# Altium project Cubesat EPS.PrjPcb (part 3 of 4)

## Sheet 3V3_EPS.SchDoc
size 420 x 297 mm; SheetNumber: 4; SheetTotal: 21
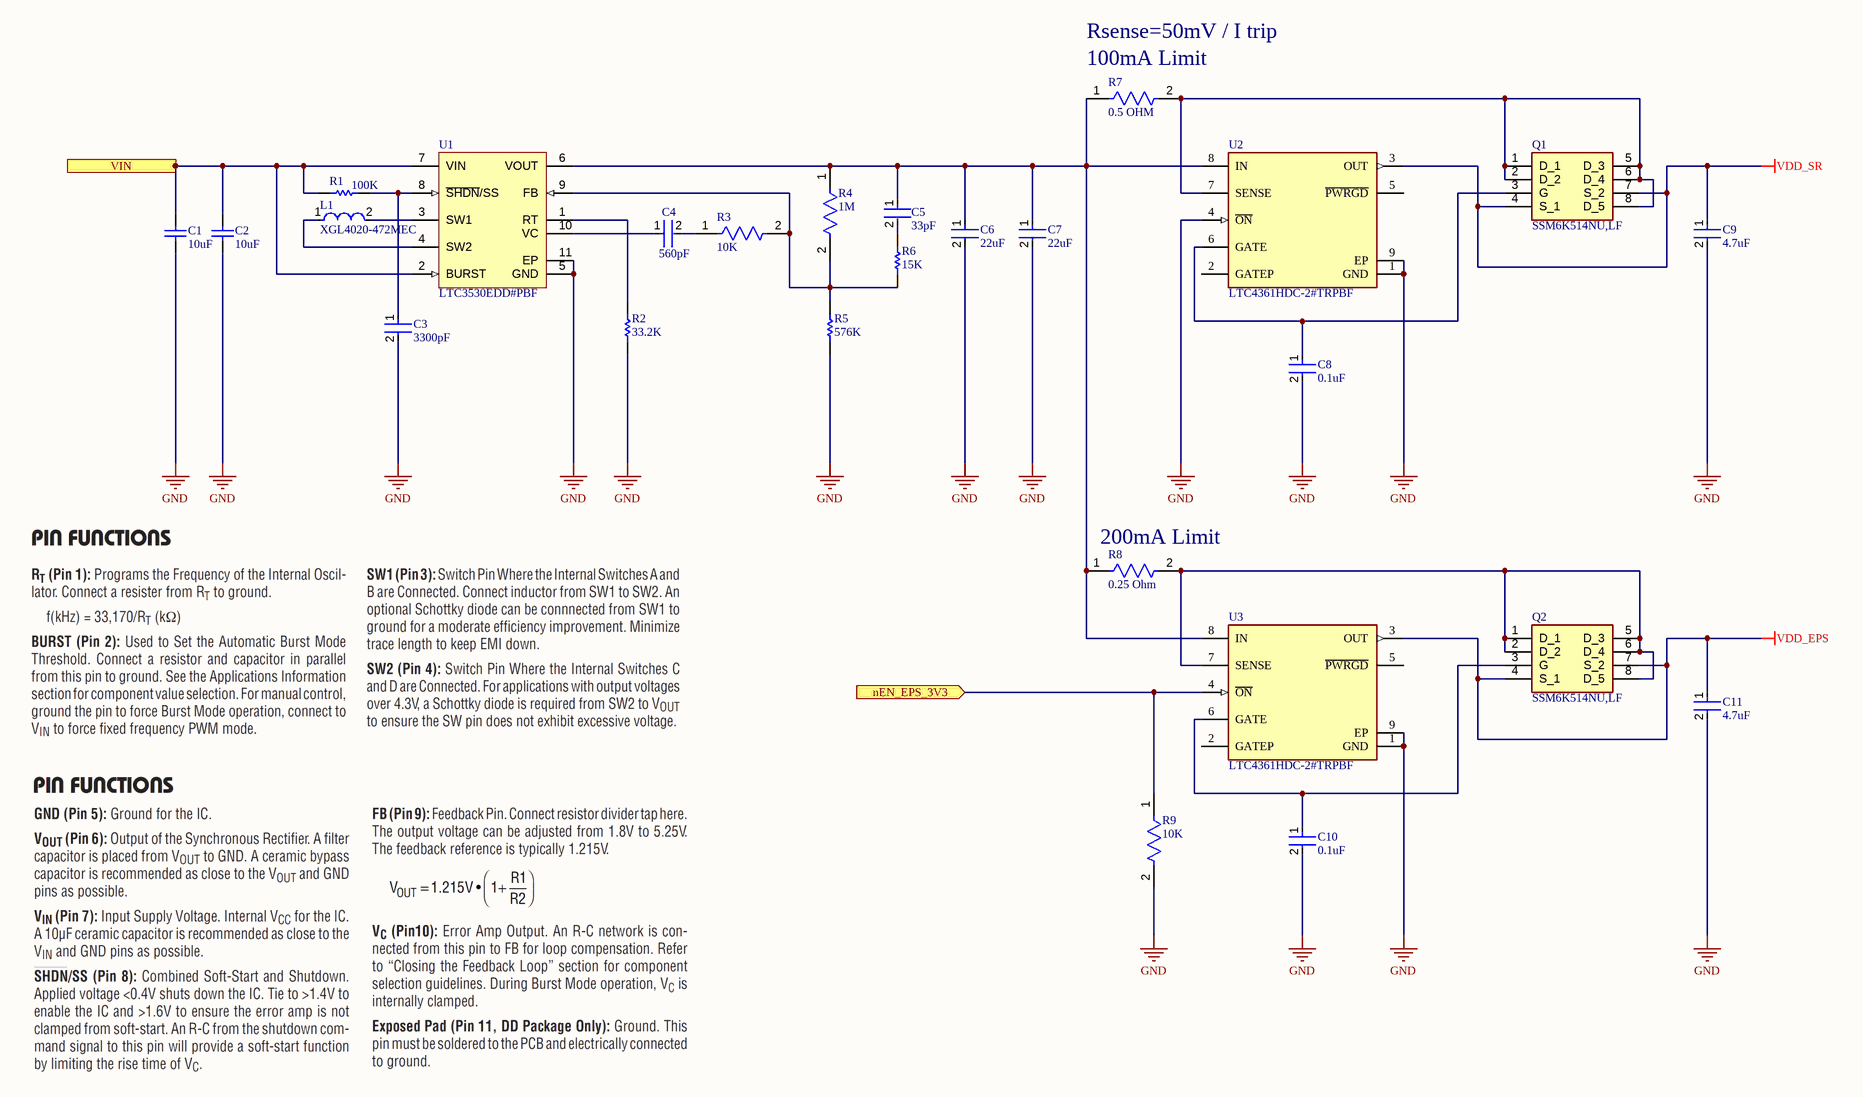
[diagram p13: 3V3_EPS.SchDoc]

### Parts
C1  10uF  [CAPC2013X140X45NL15T25]
C2  10uF  [CAPC2013X140X45NL15T25]
C3  3300pF  [FP-C0603C-CF-MFG]
C4  560pF  [FP-C0603C-CF-MFG]
C5  33pF  [FP-C0603C-CF-MFG]
C6  22uF  [FP-GRM21B-0_2-e0_2_0_7-IPC_C]
C7  22uF  [FP-GRM21B-0_2-e0_2_0_7-IPC_C]
C8  0.1uF  [FP-C0603C-CF-MFG]
C9  4.7uF  [FP-GRM188-0_15-IPC_A]
C10  0.1uF  [FP-C0603C-CF-MFG]
C11  4.7uF  [FP-GRM188-0_15-IPC_A]
L1  XGL4020-472MEC  [FP-XGL4020-MFG]
Q1  SSM6K514NU,LF  [UDFN6B]
Q2  SSM6K514NU,LF  [UDFN6B]
R1  100K  [RESC1608X55X30ML20T10]
R2  33.2K  [RESC1608X55X30NL15T15]
R3  10K  [FP-RK73B1J-MFG]
R4  1M  [FP-ERJ3EK-IPC_C]
R5  576K  [RESC1608X55X30LL15T15]
R6  15K  [RESC1608X55X30NL20T10]
R7  0.5 OHM  [FP-CSR0603-IPC_A]
R8  0.25 Ohm  [FP-CSR0603-IPC_A]
R9  10K  [FP-RK73B1J-MFG]
U1  LTC3530EDD#PBF  [LT-DD-10_V]
U2  LTC4361HDC-2#TRPBF  [FP-DC8-8-05-08-1719-IPC_C]
U3  LTC4361HDC-2#TRPBF  [FP-DC8-8-05-08-1719-IPC_C]

### Ports
nEN_EPS_3V3 (in), VIN

### Nets
GND: C1.1 C2.1 C3.2 C6.2 C7.2 C8.2 C9.2 C10.2 C11.2 R2.1 R5.1 R9.2 U1.5(GND) U1.11(EP) U2.1(GND) U2.4(~{ON}) U2.9(EP) U3.1(GND) U3.9(EP)
VDD_EPS: C11.1 Q2.4(S_1) Q2.7(S_2) U3.3(OUT)
VDD_SR: C9.1 Q1.4(S_1) Q1.7(S_2) U2.3(OUT)
nEN_EPS_3V3: R9.1 U3.4(~{ON}) ; port nEN_EPS_3V3
VBUS: C1.2 C2.2 R1.2 U1.2(BURST) U1.7(VIN) ; port VIN
NetC3_1: C3.1 R1.1 U1.8(~{SHDN}/SS)
NetC4_1: C4.1 U1.10(VC)
NetC4_2: C4.2 R3.1
NetC5_1: C5.1 C6.1 C7.1 R4.1 R7.1 R8.1 U1.6(VOUT) U2.8(IN) U3.8(IN)
NetC5_2: C5.2 R6.2
NetC8_1: C8.1 Q1.3(G) U2.6(GATE)
NetC10_1: C10.1 Q2.3(G) U3.6(GATE)
NetL1_1: L1.1 U1.4(SW2)
NetL1_2: L1.2 U1.3(SW1)
NetQ1_1: Q1.1(D_1) Q1.2(D_2) Q1.5(D_3) Q1.6(D_4) Q1.8(D_5) R7.2 U2.7(SENSE)
NetQ2_1: Q2.1(D_1) Q2.2(D_2) Q2.5(D_3) Q2.6(D_4) Q2.8(D_5) R8.2 U3.7(SENSE)
NetR2_2: R2.2 U1.1(RT)
NetR3_2: R3.2 R4.2 R5.2 R6.1 U1.9(FB)

Not connected (* = marked no-connect by the designer): U2 2(GATEP) 5(~{PWRGD}); U3 2(GATEP) 5(~{PWRGD})

### Notes on the sheet
- Rsense=50mV / I trip
- (near R7) 100mA Limit
- (near R8) 200mA Limit
- THIS DOCUMENT AND THE DATA DISCLOSED HEREIN OR
- HEREWITH IS THE PROPERTY OF ALTIUM LIMITED AND MAY
- DWG NO:
- REVISION
- REV:
- DESCRIPTION
- DATE
- APPROVED
- BE FREELY DISTRIBUTED IN WHOLE. NO RIGHTS ARE
- RESERVED OR EXPRESS OR IMPLIED WARANTEE GIVEN.
- ENG:
- APPROVALS
- PROJECT
- DSN:
- CHK:
- REFERENCE DOCUMENTS
- PROJECT REVISION:
- TITLE
- DOCUMENT REVISION:
- DESIGN ITEM:
- BOM:
- FAB DWG:
- PCB DWG:
- ASSY DWG:
- SCALE:
- A3
- SIZE
- CAGE CODE
- FILE NAME
- DWG NO.
- SHEET
- OF
- REV

### Library data of the parts
C1 C2 = CMP-2007-03395-1: 10uF 0805; Part Number: GRM21BR71A106KE51L; Manufacturer: Murata
C3 = CMP-2006-03174-2: CAP CER 3300PF 50V 5% X7R 0603; Manufacturer Part Number: C0603C332J5RACTU; Manufacturer: KEMET; Automotive Grade: Grade 1; Material: Ceramic; Value: 3,300 pF; Temperature Coefficient: 30ppm/°C; Tolerance: 0.05; Temperature Range Low: -55°C; Device Class L3: Ceramic Capacitors; Temperature Characteristic: X7R; Temperature: -55°C to +125°C; Device Class L1: Passive Components; ComponentLink2URL: https://api.kemet.com/component-edge/download/datasheet/C0603C100J5GACAUTO.pdf; Automotive: Yes; Capacitance: 3,300 pF; RoHS: TRUE; Mouser Description: Multilayer Ceramic Capacitors MLCC - SMD/SMT 50volts 3300pF X7R 5%; Height: 0.87mm; Temperature Range High: +125°C; ComponentLink2Description: Datasheet; Voltage Rating: 50 V; Octopart: https://octopart.com/c0603c332j5ractu-kemet-9139905; Package: C0603C-CF; Lead Free: Yes; Device Class L2: Capacitors; Digikey Description: CAP CER 3300PF 50V 5% X7R 0603; Category: Cap
C4 = CMP-2006-03245-2: CAP CER 560PF 50V X7R 0603; Manufacturer Part Number: C0603C561K5RACTU; Manufacturer: KEMET; Tolerance: 0.1; Material: Ceramic; Automotive Grade: Grade 1; Temperature Coefficient: 30ppm/°C; Temperature Range High: +125°C; Category: Cap; Voltage Rating: 50 V; Lead Free: Yes; RoHS: TRUE; Octopart: https://octopart.com/c0603c561k5ractu-kemet-138569; Device Class L3: Ceramic Capacitors; Temperature: -55°C to +125°C; Automotive: Yes; Device Class L1: Passive Components; Mouser Description: C0603C 560pF Ceramic Multilayer Capacitor, 50 VDC, +125degC, X7R Dielec, +/-10%; Capacitance: 560 pF; Temperature Characteristic: X7R; ComponentLink2URL: https://api.kemet.com/component-edge/download/datasheet/C0603C100J5GACAUTO.pdf; Temperature Range Low: -55°C; Digikey Description: CAP CER 560PF 50V X7R 0603; Device Class L2: Capacitors; ComponentLink2Description: Datasheet; Package: C0603C-CF; Value: 560 pF; Height: 0.87mm
C5 = CMP-03020-019617-1: CAP CER 33PF 16V X7R 0603; Manufacturer Part Number: C0603C330K4RAC7867; Manufacturer: KEMET; Material: Ceramic; Temperature Coefficient: 30ppm/°C; Automotive Grade: Grade 1; Tolerance: 0.1; Capacitance: 33 pF; ComponentLink2Description: Datasheet; ComponentLink2URL: https://api.kemet.com/component-edge/download/datasheet/C0603C100J5GACAUTO.pdf; Height: 0.87mm; Octopart: https://octopart.com/c0603c330k4rac7867-kemet-83501964; Temperature Characteristic: X7R; Temperature: -55°C to +125°C; RoHS: TRUE; Device Class L3: Ceramic Capacitors; Device Class L1: Passive Components; Digikey Description: CAP CER 33PF 16V X7R 0603; Lead Free: Yes; Temperature Range High: +125°C; Voltage Rating: 16 V; Package: C0603C-CF; Category: Cap; Automotive: Yes; Temperature Range Low: -55°C; Device Class L2: Capacitors; Value: 33 pF
C6 C7 = CMP-06035-025845-1: Chip Multilayer Ceramic Capacitors for General Purpose, 0805, 22uF, X7T, +22%/-33%, 20%, 10V; Dissipation Factor: 0.035%; Height: 1.25mm; Min Operating Temperature: -55°C; Case/Package: 0805; Packaging: Tape and Reel; Voltage: 10V; Depth: 1.25mm; Width: 1.25mm; Voltage Rating: 10V; Dielectric: X7T; Weight: 0.000335oz; Capacitance: 22uF; Mount: Surface Mount; Package Quantity: 3000; Lead Free: Lead Free; Tolerance: 20%; Thickness: 0.057inch; Max Operating Temperature: 125°C; Length: 2mm; Material: Ceramic; Case Code (Metric): 2012; Termination: SMD/SMT; Voltage Rating (DC): 10V; Dielectric Material: Ceramic; Case Code (Imperial): 0805
C8 C10 = CMP-2006-03054-2: CAP CER 0.1UF 16V X7R 0603; Manufacturer: KEMET; Manufacturer Part Number: C0603C104J4RACTU; Material: Ceramic; Capacitance: 0.10 μF; Tolerance: 0.05; Automotive Grade: Grade 1; Value: 0.10 μF; Temperature Coefficient: 30ppm/°C; Digikey Description: CAP CER 0.1UF 16V X7R 0603; Automotive: Yes; Octopart: https://octopart.com/c0603c104j4ractu-kemet-102515; Device Class L2: Capacitors; Temperature Characteristic: X7R; Category: Cap; Mouser Description: Cap Ceramic 0.1uF 16V X7R 5% SMD 0603 125°C Paper T/R; Voltage Rating: 16 V; Temperature Range Low: -55°C; Device Class L1: Passive Components; ComponentLink2URL: https://api.kemet.com/component-edge/download/datasheet/C0603C100J5GACAUTO.pdf; Lead Free: Yes; Temperature Range High: +125°C; Height: 0.87mm; Device Class L3: Ceramic Capacitors; ComponentLink2Description: Datasheet; Package: C0603C-CF; RoHS: TRUE; Temperature: -55°C to +125°C
C9 C11 = CMP-06035-000034-2: as C62 on sheet PMIC_Power; Height: 0.8mm; Termination: SMD/SMT; Case Code (Metric): 1608; Voltage Rating: 10V; Width: 0.8mm; Resistor Type: Ceramic; Length: 1.6mm; Voltage Rating (DC): 10V; Weight: 0.000222oz; Dielectric: X7S; Package Quantity: 4000; Mount: Surface Mount; Case Code (Imperial): 0603; Case/Package: 0603; Packaging: Tape and Reel; Thickness: 0.037inch; Min Operating Temperature: -55°C; Capacitance: 4.7uF; Max Operating Temperature: 125°C
L1 = CMP-11268-000013-1: Inductor, power, 4.7uH, SMT; Manufacturer: Coilcraft; Self Resonant Frequency: 23MHz; Saturation Current: 1.9A; Shielding: true; Test Frequency: 1MHz; Tolerance: 20%; Rms Current: 5.6A; Core Material: Composite; Series Resistance: 47.3mΩ; Automotive Grade: Grade 1; Standoff Height: 0.06mm; Inductance: 4.7uH; ComponentLink2Description: Datasheet; Value: 4.7uH; Automotive: Yes; RoHS: TRUE; Device Class L1: Passive Components; Category: Ind; Manufacturer Part Number: XGL4020-472MEC; ComponentLink2URL: https://www.coilcraft.com/pdfs/xgl4020.pdf; Ambient Temperature Range Low: -40°C; Height: 2.1mm; Octopart: https://octopart.com/xgl4020-472mec-coilcraft-99681031; Device Class L2: Inductors; Ambient Temperature Range High: +125°C; Package: XGL4020; Lead Free: Yes; Composition: Wirewound; Device Class L3: Fixed Inductors
Q1 Q2 = SSM6K514NU,LF: MOSFET (N-Channel); Manufacturer_Name: Toshiba; Datasheet Link: http://toshiba.semicon-storage.com/info/docget.jsp?did=29875&prodName=SSM6N7002CFU; Manufacturer_Part_Number: SSM6K514NU,LF; Mouser Part Number: 757-SSM6K514NULF; Mouser Price/Stock: https://www.mouser.co.uk/ProductDetail/Toshiba/SSM6K514NULF?qs=yfGysFjEcj13lHFOvblArQ%3D%3D; Arrow Part Number: SSM6K514NU,LF; Arrow Price/Stock: https://www.arrow.com/en/products/ssm6k514nulf/toshiba?region=nac
R1 = CMP-2000-01852-1: Part Number: RK73B1JTTD104J; Manufacturer: KOA Speer
R2 = CMP-2000-00441-1: Part Number: ERJ-3EKF3322V; Manufacturer: Panasonic
R3 R9 = CMP-2000-01851-2: as R67 on sheet PMIC_Watchdog; Length: 1.6mm; Lead Free: Lead Free; Resistance Tolerance: 5%; Case Code (Metric): 1608; Width: 0.8mm; Height: 0.45mm; Max Operating Temperature: 155°C; RoHS Compliant: Yes; Resistor Type: Thick Film; Min Operating Temperature: -55°C; Case Code (Imperial): 0603; Technology: THICK FILM; Package Quantity: 5000; Tolerance: 5%; Case/Package: 0603; Voltage Rating (DC): 50V; Depth: 0.8mm; Packaging: Tape and Reel; Number of Pins: 2; Construction: Rectangular; Series: RK73B; Military Standard: Not; Termination: SMD/SMT
R4 = CMP-1012-00849-3: RES SMD 1M OHM 1% 1/10W 0603; Resistance: 1MR; Voltage Rating: 75V; Temperature Coefficient: 100ppm/°C; Power Rating: 100mW; REACH SVHC: No SVHC; Radiation Hardening: No; Features: Automotive AEC-Q200; Case Code (Metric): 1608; Resistance Tolerance: 1%; Case/Package: 0603; Termination: SMD/SMT; Max Operating Temperature: 155°C; Tolerance: 1%; Size Code: 0603; Case Code (Imperial): 0603; Min Operating Temperature: -55°C; Number of Pins: 2; Mount: Surface Mount; Package Quantity: 1; Military Standard: Not; Voltage Rating (DC): 75V; Depth: 0.8mm; Packaging: Tape and Reel; Width: 0.8mm; Number of Terminations: 2; Length: 1.6mm; Height: 0.022inch; RoHS Compliant: Yes; Resistor Type: Thick Film; Contact Plating: Tin; Lead Free: Lead Free; Series: ERJ; Construction: Rectangular; Max Power Dissipation: 100mW
R5 = CMP-2000-00577-1: 576K Ohm 0603; Part Number: ERJ-3EKF5763V; Manufacturer: Panasonic
R6 = CMP-2000-01876-1: 15K Ohm 0603; Part Number: RK73B1JTTD153J; Manufacturer: KOA Speer
R7 = CMP-26527-000571-1: General Purpose Thick Film Chip Resistor, 0603, 0.5Ω, 1%, 300ppm/°C, 0.125W; Resistance: 500mR; Max Power Dissipation: 125mW; Resistor Type: Thick Film; Series: CSR; Case/Package: 0603; Mount: Surface Mount; Tolerance: 1%; Max Operating Temperature: 155°C; Width: 0.031inch; Length: 0.063inch; Min Operating Temperature: -55°C; Contact Plating: Tin; Size Code: 0603; Lead Free: Lead Free; Height: 0.022inch; Case Code (Imperial): 0603; Packaging: Tape and Reel; Power Rating: 125mW; RoHS Compliant: Yes; Case Code (Metric): 1608; Temperature Coefficient: 300ppm/°C; Number of Terminations: 2
R8 = CMP-26527-001850-1: General Purpose Thick Film Chip Resistor, 0603, 0.25Ω, 1%, 300ppm/°C, 0.125W; Max Power Dissipation: 125mW; Resistance: 250mR; Length: 0.063inch; Case Code (Metric): 1608; Temperature Coefficient: 300ppm/°C; Mount: Surface Mount; RoHS Compliant: Yes; Height: 0.022inch; Case/Package: 0603; Series: CSR; Max Operating Temperature: 155°C; Case Code (Imperial): 0603; Min Operating Temperature: -55°C; Lead Free: Lead Free; Resistor Type: Thick Film; Tolerance: 1%; Width: 0.031inch; Packaging: Tape and Reel; Number of Terminations: 2; Contact Plating: Tin
U1 = CMP-0492-00076-1: Wide Input Voltage Synchronous Buck-Boost DC/DC Converter, 10-pin SON (DD-10), -40 to 85 degC, Pb-Free; Manufacturer: Linear Technology; Frequency Adjust Range: 300kHz - 2MHz; Number of Outputs: 1; ComponentLink1URL: http://www.linear.com/; RoHS: TRUE; ComponentLink2URL: http://cds.linear.com/docs/en/datasheet/3530fb.pdf; ComponentLink3URL: http://cds.linear.com/docs/en/packaging/DFN_10_05-08-1699.pdf; PackageDescription: 10-Pin Plastic DFN, Body 3 x 3 mm, Pitch 0.5 mm; PackageReference: DD-10; ComponentLink1Description: Manufacturer URL; PackageVersion: Rev. C, 06/2010; Mounting Technology: Surface Mount; ComponentLink3Description: Package Specification; ComponentLink2Description: Datasheet; PartNumber: LTC3530EDD#PBF; DatasheetVersion: Rev. B; Code_JEDEC: MO-229
U2 U3 = CMP-0474-00015-2: IC OVP/OCP PROTECTION CTLR 8DFN; Number of Circuits: 1; RoHS Compliant: Yes; Packaging: Tape and Reel; Case/Package: DFN; Number of Pins: 8; Package Quantity: 2500

## Sheet UnRegPower.SchDoc
size 420 x 297 mm; SheetNumber: 8; SheetTotal: 21
Used 2 times, as channels M, N. Parts and nets are listed once, with the designators drawn on the sheet.
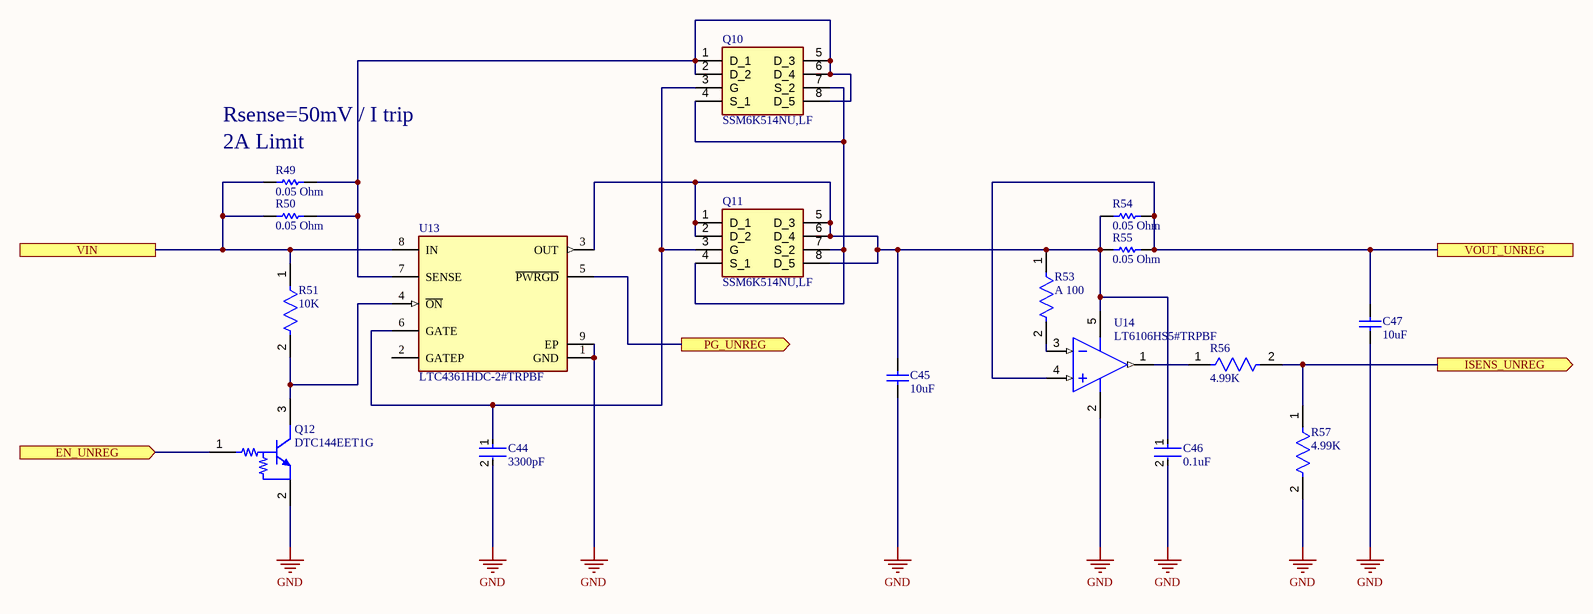
[diagram p14: UnRegPower.SchDoc]

### Parts
C44  3300pF  [FP-C0603C-CF-MFG]
C45  10uF  [CAPC2013X140X45NL15T25]
C46  0.1uF  [FP-C0603C-CF-MFG]
C47  10uF  [CAPC2013X140X45NL15T25]
Q10  SSM6K514NU,LF  [UDFN6B]
Q11  SSM6K514NU,LF  [UDFN6B]
Q12  DTC144EET1G  [ONSC-SC-75-3-463-01_V]
R49  0.05 Ohm  [RESC1608X55X30NL15T15]
R50  0.05 Ohm  [RESC1608X55X30NL15T15]
R51  10K  [FP-RK73B1J-MFG]
R53  A 100  [FP-ERA3A-IPC_B]
R54  0.05 Ohm  [RESC1608X55X30NL15T15]
R55  0.05 Ohm  [RESC1608X55X30NL15T15]
R56  4.99K  [FP-ERA3A-IPC_C]
R57  4.99K  [FP-ERA3A-IPC_C]
U13  LTC4361HDC-2#TRPBF  [FP-DC8-8-05-08-1719-IPC_C]
U14  LT6106HS5#TRPBF  [LT-S5-5-TSOT-23_M]

### Ports
EN_UNREG (in), ISENS_UNREG (out), PG_UNREG (out), VIN, VOUT_UNREG

### Nets
GND: C44.2 C45.1 C46.2 C47.1 Q12.2(E) R57.2 U13.1(GND) U13.9(EP) U14.2(V-)
EN_UNREG: Q12.1(B) ; port EN_UNREG
ISENS_UNREG: R56.2 R57.1 ; port ISENS_UNREG
PG_UNREG: U13.5(~{PWRGD}) ; port PG_UNREG
VIN: R49.1 R50.1 R51.1 U13.8(IN) ; port VIN
VOUT_UNREG: C47.2 R54.2 R55.2 U14.4(+IN) ; port VOUT_UNREG
NetC44_1: C44.1 Q10.3(G) Q11.3(G) U13.6(GATE)
NetC45_2: C45.2 C46.1 Q11.1(D_1) Q11.2(D_2) Q11.5(D_3) Q11.6(D_4) Q11.8(D_5) R53.1 R54.1 R55.1 U13.3(OUT) U14.5(V+)
NetQ10_1: Q10.1(D_1) Q10.2(D_2) Q10.5(D_3) Q10.6(D_4) Q10.8(D_5) R49.2 R50.2 U13.7(SENSE)
NetQ10_4: Q10.4(S_1) Q10.7(S_2) Q11.4(S_1) Q11.7(S_2)
NetQ12_3: Q12.3(C) R51.2 U13.4(~{ON})
NetR53_2: R53.2 U14.3(-IN)
NetR56_1: R56.1 U14.1(OUT)

Not connected (* = marked no-connect by the designer): U13 2(GATEP)

### Channels
M: designators end in _M; ports EN_UNREG=EN_UNREG1 ISENS_UNREG=ADC3_IN2 PG_UNREG=PG_UNREG1 VIN=VBUS VOUT_UNREG=UNREG_1
N: designators end in _N; ports EN_UNREG=EN_UNREG2 ISENS_UNREG=ADC3_IN1 PG_UNREG=PG_UNREG2 VIN=VBUS VOUT_UNREG=UNREG_2

### Notes on the sheet
- Rsense=50mV / I trip
- (near R49) 2A Limit
- THIS DOCUMENT AND THE DATA DISCLOSED HEREIN OR
- HEREWITH IS THE PROPERTY OF ALTIUM LIMITED AND MAY
- DWG NO:
- REVISION
- REV:
- DESCRIPTION
- DATE
- APPROVED
- BE FREELY DISTRIBUTED IN WHOLE. NO RIGHTS ARE
- RESERVED OR EXPRESS OR IMPLIED WARANTEE GIVEN.
- ENG:
- APPROVALS
- PROJECT
- DSN:
- CHK:
- REFERENCE DOCUMENTS
- PROJECT REVISION:
- TITLE
- DOCUMENT REVISION:
- DESIGN ITEM:
- BOM:
- FAB DWG:
- PCB DWG:
- ASSY DWG:
- SCALE:
- A3
- SIZE
- CAGE CODE
- FILE NAME
- DWG NO.
- SHEET
- OF
- REV

### Library data of the parts
C44 = CMP-2006-03174-2: as C3 on sheet 3V3_EPS; Temperature Range Low: -55°C; Device Class L3: Ceramic Capacitors; Temperature Characteristic: X7R; Temperature: -55°C to +125°C; Device Class L1: Passive Components; ComponentLink2URL: https://api.kemet.com/component-edge/download/datasheet/C0603C100J5GACAUTO.pdf; Automotive: Yes; Capacitance: 3,300 pF; RoHS: TRUE; Mouser Description: Multilayer Ceramic Capacitors MLCC - SMD/SMT 50volts 3300pF X7R 5%; Height: 0.87mm; Temperature Range High: +125°C; ComponentLink2Description: Datasheet; Voltage Rating: 50 V; Octopart: https://octopart.com/c0603c332j5ractu-kemet-9139905; Package: C0603C-CF; Lead Free: Yes; Device Class L2: Capacitors; Digikey Description: CAP CER 3300PF 50V 5% X7R 0603; Category: Cap
C45 C47 = CMP-2007-03395-1: Part Number: GRM21BR71A106KE51L; Manufacturer: Murata
C46 = CMP-2006-03061-2: as C67 on sheet PMIC_Watchdog; Temperature: -55°C to +125°C; RoHS: TRUE; Temperature Range High: +125°C; Lead Free: Yes; Octopart: https://octopart.com/c0603c104k5ractu-kemet-139244; Digikey Description: CAP CER 0.1UF 50V X7R 0603; Category: Cap; Package: C0603C-CF; ComponentLink2Description: Datasheet; Temperature Range Low: -55°C; Device Class L1: Passive Components; Voltage Rating: 50 V; Automotive: Yes; Device Class L3: Ceramic Capacitors; ComponentLink2URL: https://api.kemet.com/component-edge/download/datasheet/C0603C100J5GACAUTO.pdf; Capacitance: 0.10 μF; Device Class L2: Capacitors; Temperature Characteristic: X7R; Height: 0.87mm
Q10 Q11 = SSM6K514NU,LF: as Q1 on sheet 3V3_EPS; Datasheet Link: http://toshiba.semicon-storage.com/info/docget.jsp?did=29875&prodName=SSM6N7002CFU; Manufacturer_Part_Number: SSM6K514NU,LF; Mouser Part Number: 757-SSM6K514NULF; Mouser Price/Stock: https://www.mouser.co.uk/ProductDetail/Toshiba/SSM6K514NULF?qs=yfGysFjEcj13lHFOvblArQ%3D%3D; Arrow Part Number: SSM6K514NU,LF; Arrow Price/Stock: https://www.arrow.com/en/products/ssm6k514nulf/toshiba?region=nac
Q12 = CMP-0630-00198-1: Digital Transistor (BRT), R1=47 kOhm, R2=47 kOhm, NPN Transistor, 3-Pin SC-75, Pb-Free, Tape and Reel; Manufacturer: On Semiconductor; hFE Min: 80; R1/R2 Typ: 1; IC Continuous (A): 0.1; V(BR)CEO Min (V): 50; Mounting Technology: Surface Mount; PartNumber: DTC144EET1G; Polarity: NPN; PackageReference: SC-75-3-463-01; ComponentLink2URL: http://www.onsemi.cn/pub_link/Collateral/DTC144E-D.PDF; PackageVersion: Rev. F, 07/2005; ComponentLink3Description: Package Specification; ComponentLink1Description: Manufacturer URL; ComponentLink1URL: http://www.onsemi.com/; DatasheetVersion: Rev. 2; Packing: Tape and Reel; PackageDescription: 3-Pin Small Outline Transistor, Body 1.6 x 0.8 mm, Pitch 0.5 mm; ComponentLink2Description: Datasheet; RoHS: TRUE; ComponentLink3URL: http://www.onsemi.com/pub_link/Collateral/463-01.PDF
R49 R50 R54 R55 = CMP-2000-00867-1: Manufacturer: Panasonic; Part Number: ERJ-L03KF50MV
R51 = CMP-2000-01851-2: as R67 on sheet PMIC_Watchdog; Length: 1.6mm; Lead Free: Lead Free; Resistance Tolerance: 5%; Case Code (Metric): 1608; Width: 0.8mm; Height: 0.45mm; Max Operating Temperature: 155°C; RoHS Compliant: Yes; Resistor Type: Thick Film; Min Operating Temperature: -55°C; Case Code (Imperial): 0603; Technology: THICK FILM; Package Quantity: 5000; Tolerance: 5%; Case/Package: 0603; Voltage Rating (DC): 50V; Depth: 0.8mm; Packaging: Tape and Reel; Number of Pins: 2; Construction: Rectangular; Series: RK73B; Military Standard: Not; Termination: SMD/SMT
R53 = CMP-2000-00870-2: RES SMD 100 OHM 0.1% 1/10W 0603; Voltage Rating: 75V; Power Rating: 100mW; Resistance: 100R; Temperature Coefficient: 25ppm/°C; Number of Terminations: 2; Case/Package: 0603; Termination: SMD/SMT; Number of Pins: 2; Size Code: 0603; Length: 1.6mm; Min Operating Temperature: -55°C; Resistor Type: Thin Film; Depth: 0.8mm; Military Standard: Not; Packaging: Tape and Reel; RoHS Compliant: Yes; Construction: Rectangular; Resistance Tolerance: 0.1%; Contact Plating: Tin; Width: 0.8mm; Mount: Surface Mount; Case Code (Metric): 1608; Max Operating Temperature: 155°C; Height: 0.45mm; Case Code (Imperial): 0603; Series: ERA-3A; Package Quantity: 5000; REACH SVHC: No SVHC; Tolerance: 0.1%; Max Power Dissipation: 100mW; Radiation Hardening: No; Technology: METAL FILM
R56 R57 = CMP-2000-00077-5: RES SMD 4.99KOHM 0.1% 1/10W 0603; Voltage Rating (DC): 75V; Max Power Dissipation: 100mW; Temperature Coefficient: 25ppm/°C; Resistance: 4.99kR; Voltage Rating: 150V; Features: Automotive AEC-Q200; Depth: 0.8mm; Case Code (Imperial): 0603; Resistance Tolerance: 0.1%; Mount: Surface Mount; Contact Plating: Tin; Length: 1.6mm; RoHS Compliant: Yes; Termination: SMD/SMT; Width: 0.8mm; Case/Package: 0603; Series: ERA; Radiation Hardening: No; Tolerance: 0.1%; Lead Free: Lead Free; Technology: METAL FILM; Construction: Rectangular; Number of Terminations: 2; Weight: 7.1E-05oz; Power Rating: 100mW; Number of Pins: 2; Min Operating Temperature: -55°C; Height: 0.45mm; Case Code (Metric): 1608; Package Quantity: 5000; Military Standard: Not; Max Operating Temperature: 155°C; Resistor Type: Thin Film; Reach SVHC Compliant: Yes; Packaging: Tape and Reel
U13 = CMP-0474-00015-2: as U2 on sheet 3V3_EPS; RoHS Compliant: Yes; Packaging: Tape and Reel; Case/Package: DFN; Number of Pins: 8; Package Quantity: 2500
U14 = CMP-0359-01984-2: Single Channel, Low Cost, High Side Current Sense Operational Amplifier, 0.2 MHz Typical GBW, 5-Pin SOT-23 (S5-5), High Temperature / Automotive, Pb-Free, Reel; Manufacturer: Linear Technology; Linear Technology Part Number: LT6106; Vos (mV) Typical: 0.15; Vs Min (V): 2.7; Vs Max (V): 36; Is (mA) Typical: 0.06; Vos (mV) Guaranteed: 0.25; Channels (#): 1; GBW (MHz) Typical: 0.2; PackageDescription: 5-Lead Plastic TSOT-23, Body 1.63 x 2.90 mm, Pitch 0.95 mm; ComponentLink3Description: Package Specification; Mounting Technology: Surface Mount; Type: CSA; RevisionNote: URLs updated; ComponentLink2URL: http://cds.linear.com/docs/en/datasheet/6106fa.pdf; ComponentLink1URL: http://www.linear.com/; Code_JEDEC: MO-193; PartNumber: LT6106HS5#TRPBF; Packing: Reel; DatasheetVersion: Rev. A; RoHS: Pb-Free; ComponentLink3URL: http://cds.linear.com/docs/en/packaging/SOT_5_05-08-1635.pdf; ComponentLink1Description: Manufacturer URL; PackageReference: LT-S5-5-TSOT-23; ComponentLink2Description: Datasheet

## Sheet SetResetIC.SchDoc
size 420 x 297 mm; SheetNumber: 9; SheetTotal: 21
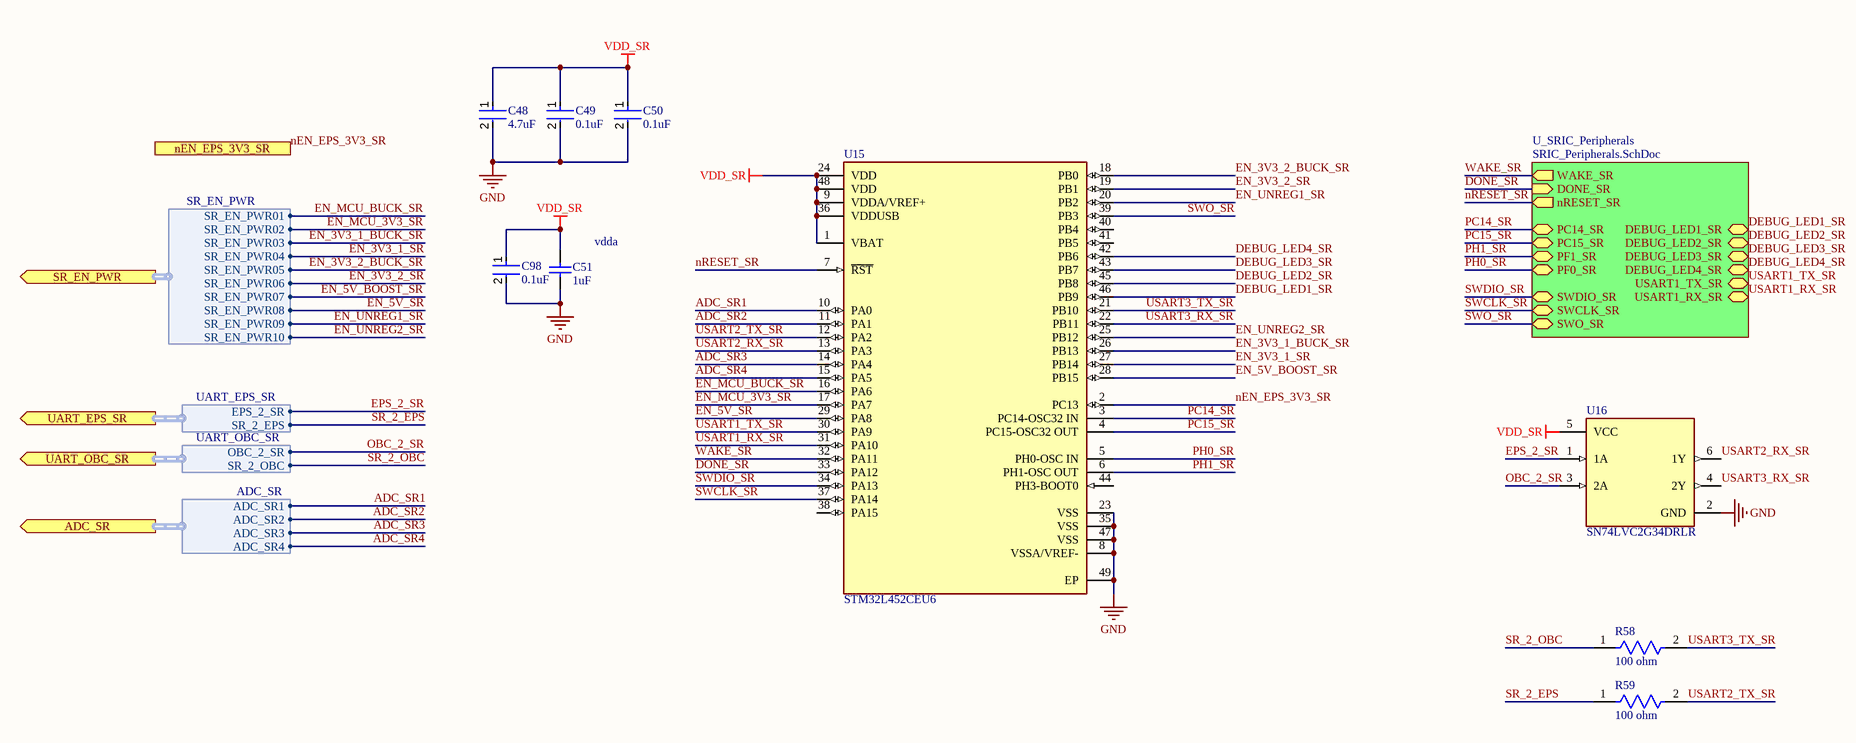
[diagram p15: SetResetIC.SchDoc]

### Parts
C48  4.7uF  [FP-GRM188-0_15-IPC_A]
C49  0.1uF  [FP-C0603C-CF-MFG]
C50  0.1uF  [FP-C0603C-CF-MFG]
C51  1uF  [CAPC1608X90X35ML10T15]
C98  0.1uF  [FP-C0603C-CF-MFG]
R58  100 ohm  [FP-ERJP03-MFG]
R59  100 ohm  [FP-ERJP03-MFG]
U15  STM32L452CEU6  [FP-UFQFPN48-A0B9-MFG]
U16  SN74LVC2G34DRLR  [FP-DRL0006A-MFG]

### Sub-sheets
U_SRIC_Peripherals = SRIC_Peripherals.SchDoc: WAKE_SR (out), nRESET_SR (out), DONE_SR (in), SWDIO_SR (bidir), SWCLK_SR (bidir), SWO_SR (bidir), DEBUG_LED1_SR (bidir), DEBUG_LED2_SR (bidir), DEBUG_LED3_SR (bidir), DEBUG_LED4_SR (bidir), PC14_SR (bidir), PC15_SR (bidir), PF1_SR (bidir), PF0_SR (bidir), USART1_TX_SR (bidir), USART1_RX_SR (bidir)

### Ports
ADC_SR (out, harness ADC_SR), nEN_EPS_3V3_SR (out), SR_EN_PWR (out, harness SR_EN_PWR), UART_EPS_SR (out, harness UART_EPS_SR), UART_OBC_SR (out, harness UART_OBC_SR)

### Harnesses
SR_EN_PWR: SR_EN_PWR01, SR_EN_PWR02, SR_EN_PWR03, SR_EN_PWR04, SR_EN_PWR05, SR_EN_PWR06, SR_EN_PWR07, SR_EN_PWR08, SR_EN_PWR09, SR_EN_PWR10
UART_EPS_SR: EPS_2_SR, SR_2_EPS
UART_OBC_SR: OBC_2_SR, SR_2_OBC
ADC_SR: ADC_SR1, ADC_SR2, ADC_SR3, ADC_SR4

### Nets
GND: C48.2 C49.2 C50.2 C51.1 C98.2 U15.8(VSSA/VREF-) U15.23(VSS) U15.35(VSS) U15.47(VSS) U15.49(EP) U16.2(GND)
VDD_SR: C48.1 C49.1 C50.1 C51.2 C98.1 U15.1(VBAT) U15.9(VDDA/VREF+) U15.24(VDD) U15.36(VDDUSB) U15.48(VDD) U16.5(VCC)
ADC_SR1: U15.10(PA0) ; port ADC_SR.ADC_SR1
ADC_SR2: U15.11(PA1) ; port ADC_SR.ADC_SR2
ADC_SR3: U15.14(PA4) ; port ADC_SR.ADC_SR3
ADC_SR4: U15.15(PA5) ; port ADC_SR.ADC_SR4
DEBUG_LED1_SR: U15.46(PB9) ; sheet U_SRIC_Peripherals/DEBUG_LED1_SR
DEBUG_LED2_SR: U15.45(PB8) ; sheet U_SRIC_Peripherals/DEBUG_LED2_SR
DEBUG_LED3_SR: U15.43(PB7) ; sheet U_SRIC_Peripherals/DEBUG_LED3_SR
DEBUG_LED4_SR: U15.42(PB6) ; sheet U_SRIC_Peripherals/DEBUG_LED4_SR
DONE_SR: U15.33(PA12) ; sheet U_SRIC_Peripherals/DONE_SR
EN_3V3_1_BUCK_SR: U15.26(PB13) ; port SR_EN_PWR.SR_EN_PWR03
EN_3V3_1_SR: U15.27(PB14) ; port SR_EN_PWR.SR_EN_PWR04
EN_3V3_2_BUCK_SR: U15.18(PB0) ; port SR_EN_PWR.SR_EN_PWR05
EN_3V3_2_SR: U15.19(PB1) ; port SR_EN_PWR.SR_EN_PWR06
EN_5V_BOOST_SR: U15.28(PB15) ; port SR_EN_PWR.SR_EN_PWR07
EN_5V_SR: U15.29(PA8) ; port SR_EN_PWR.SR_EN_PWR08
EN_MCU_3V3_SR: U15.17(PA7) ; port SR_EN_PWR.SR_EN_PWR02
EN_MCU_BUCK_SR: U15.16(PA6) ; port SR_EN_PWR.SR_EN_PWR01
EN_UNREG1_SR: U15.20(PB2) ; port SR_EN_PWR.SR_EN_PWR09
EN_UNREG2_SR: U15.25(PB12) ; port SR_EN_PWR.SR_EN_PWR10
EPS_2_SR: U16.1(1A) ; port UART_EPS_SR.EPS_2_SR
nEN_EPS_3V3_SR: U15.2(PC13) ; port nEN_EPS_3V3_SR  [project net nEN_EPS_3V3]
nRESET_SR: U15.7(~{RST}) ; sheet U_SRIC_Peripherals/nRESET_SR
OBC_2_SR: U16.3(2A) ; port UART_OBC_SR.OBC_2_SR
PC14_SR: U15.3(PC14-OSC32_IN) ; sheet U_SRIC_Peripherals/PC14_SR
PC15_SR: U15.4(PC15-OSC32_OUT) ; sheet U_SRIC_Peripherals/PC15_SR
PH0_SR: U15.5(PH0-OSC_IN) ; sheet U_SRIC_Peripherals/PF0_SR
PH1_SR: U15.6(PH1-OSC_OUT) ; sheet U_SRIC_Peripherals/PF1_SR
SR_2_EPS: R59.1 ; port UART_EPS_SR.SR_2_EPS
SR_2_OBC: R58.1 ; port UART_OBC_SR.SR_2_OBC
SWCLK_SR: U15.37(PA14) ; sheet U_SRIC_Peripherals/SWCLK_SR
SWDIO_SR: U15.34(PA13) ; sheet U_SRIC_Peripherals/SWDIO_SR
SWO_SR: U15.39(PB3) ; sheet U_SRIC_Peripherals/SWO_SR
USART1_RX_SR: U15.31(PA10) ; sheet U_SRIC_Peripherals/USART1_RX_SR
USART1_TX_SR: U15.30(PA9) ; sheet U_SRIC_Peripherals/USART1_TX_SR
USART2_RX_SR: U15.13(PA3) U16.6(1Y)
USART2_TX_SR: R59.2 U15.12(PA2)
USART3_RX_SR: U15.22(PB11) U16.4(2Y)
USART3_TX_SR: R58.2 U15.21(PB10)
WAKE_SR: U15.32(PA11) ; sheet U_SRIC_Peripherals/WAKE_SR

Not connected (* = marked no-connect by the designer): U15 38(PA15) 40(PB4) 41(PB5) 44(PH3-BOOT0)

### Notes on the sheet
- (near C51) vdda
- THIS DOCUMENT AND THE DATA DISCLOSED HEREIN OR
- HEREWITH IS THE PROPERTY OF ALTIUM LIMITED AND MAY
- DWG NO:
- REVISION
- REV:
- DESCRIPTION
- DATE
- APPROVED
- BE FREELY DISTRIBUTED IN WHOLE. NO RIGHTS ARE
- RESERVED OR EXPRESS OR IMPLIED WARANTEE GIVEN.
- ENG:
- APPROVALS
- PROJECT
- DSN:
- CHK:
- REFERENCE DOCUMENTS
- PROJECT REVISION:
- TITLE
- DOCUMENT REVISION:
- DESIGN ITEM:
- BOM:
- FAB DWG:
- PCB DWG:
- ASSY DWG:
- SCALE:
- A3
- SIZE
- CAGE CODE
- FILE NAME
- DWG NO.
- SHEET
- OF
- REV

### Library data of the parts
C48 = CMP-06035-000034-2: CAP CER 4.7UF 10V X7S 0603; Material: Ceramic; Tolerance: 10%; Height: 0.8mm; Termination: SMD/SMT; Case Code (Metric): 1608; Voltage Rating: 10V; Width: 0.8mm; Resistor Type: Ceramic; Length: 1.6mm; Voltage Rating (DC): 10V; Weight: 0.000222oz; Dielectric: X7S; Package Quantity: 4000; Mount: Surface Mount; Case Code (Imperial): 0603; Case/Package: 0603; Packaging: Tape and Reel; Thickness: 0.037inch; Min Operating Temperature: -55°C; Capacitance: 4.7uF; Max Operating Temperature: 125°C
C49 C50 C98 = CMP-2006-03061-2: CAP CER 0.1UF 50V X7R 0603; Manufacturer: KEMET; Manufacturer Part Number: C0603C104K5RACTU; Tolerance: 0.1; Temperature Coefficient: 30ppm/°C; Material: Ceramic; Automotive Grade: Grade 1; Value: 0.10 μF; Temperature: -55°C to +125°C; RoHS: TRUE; Temperature Range High: +125°C; Lead Free: Yes; Octopart: https://octopart.com/c0603c104k5ractu-kemet-139244; Digikey Description: CAP CER 0.1UF 50V X7R 0603; Category: Cap; Package: C0603C-CF; ComponentLink2Description: Datasheet; Temperature Range Low: -55°C; Device Class L1: Passive Components; Voltage Rating: 50 V; Automotive: Yes; Device Class L3: Ceramic Capacitors; ComponentLink2URL: https://api.kemet.com/component-edge/download/datasheet/C0603C100J5GACAUTO.pdf; Capacitance: 0.10 μF; Device Class L2: Capacitors; Temperature Characteristic: X7R; Height: 0.87mm
C51 = CMP-2006-02534-1: Part Number: GRM188R71C105KA12J; Manufacturer: Murata
R58 R59 = CMP-00287-21317759-1: ERJ-P03F1000V SMD Chip Resistor, 100 Ohm, ± 1%, 200 mW, 0603 [1608 Metric], Thick Film, Anti-Surge; Temperature Coefficient: 200ppm/°C; Resistance: 100Ω; Voltage Rating (DC): 150V; Power Rating: 200mW; Tolerance: 1%; Termination: Tab; RoHS: Compliant; Composition: Thick Film; Min Operating Temperature: -55°C; Contact Plating: Tin; Case Code (Metric): 1608; Case/Package: 0603; Radiation Hardening: No; Mount: Surface Mount; Voltage Rating: 150V; Packaging: Cut Tape; Length: 1.6mm; REACH SVHC: No SVHC; Max Operating Temperature: 155°C; Depth: 800µm; Number of Pins: 2; Lifecycle Status: Production; Schedule B: 8533210045, 8533210045; Military Standard: Not; Height: 550µm; NexarPartId: 21317759; Case Code (Imperial): 0603
U15 = CMP-12105-000040-2: IC MCU 32BIT 512KB FLASH 48QFPN; NexarPartId: 78661784; Number of PWM Channels: 15; Number of USART Channels: 3; Number of A/D Converters: 1; Core Architecture: ARM Cortex-M4; Data Bus Width: 32b; Interface: CAN, I2C, SPI, UART, USART, USB; Number of I2C Channels: 4; Max Supply Voltage: 3.6V; RAM Size: 160kB; Number of Channels: 10; Min Supply Voltage: 1.71V; Max Junction Temperature (Tj): 105°C; Number of I/Os: 38; Frequency: 80MHz; Nominal Supply Current: 30nA; Max Operating Temperature: 85°C; Lifecycle Status: Production; RoHS: Non-Compliant; Ambient Temperature Range High: 85°C; Number of SPI Channels: 3; Number of Timers/Counters: 1; Number of USB Channels: 1; Min Operating Temperature: -40°C; Height: 650µm; Number of D/A Converters: 1; Memory Size: 512kB; Number of ADC Channels: 10; Flash Memory Size: 512kB; Memory Type: FLASH; Number of UART Channels: 1
U16 = CMP-0859-00812-4: IC BUFFER NON-INVERT 5.5V 6SOT; Number of Bits per Element: 1; Number of Bits: 2; Low Level Output Current: 32mA; Polarity: Non-Inverting; Min Supply Voltage: 1.65V; Propagation Delay: 8.6ns; High Level Output Current: -32mA; Quiescent Current: 10uA; Contact Plating: Gold; Case/Package: SOT; Technology: CMOS; Min Operating Temperature: -40°C; Number of Elements: 2; REACH SVHC: No SVHC; Number of Channels: 2; Series: 74LVC; Number of Pins: 6; Mount: Surface Mount; Logic Function: Buffer; Number of Output Lines: 2; Packaging: Tape and Reel; Package Quantity: 4000; Radiation Hardening: No; Number of Gates: 2; Turn-On Delay Time: 8.6ns; Max Operating Temperature: 125°C; Max Supply Voltage: 5.5V; Lead Free: Lead Free; RoHS Compliant: Yes; Number of Outputs: 2; Number of Inputs: 2; Number of Input Lines: 2

## Sheet SRIC_Peripherals.SchDoc
size 420 x 297 mm; SheetNumber: 10; SheetTotal: 21
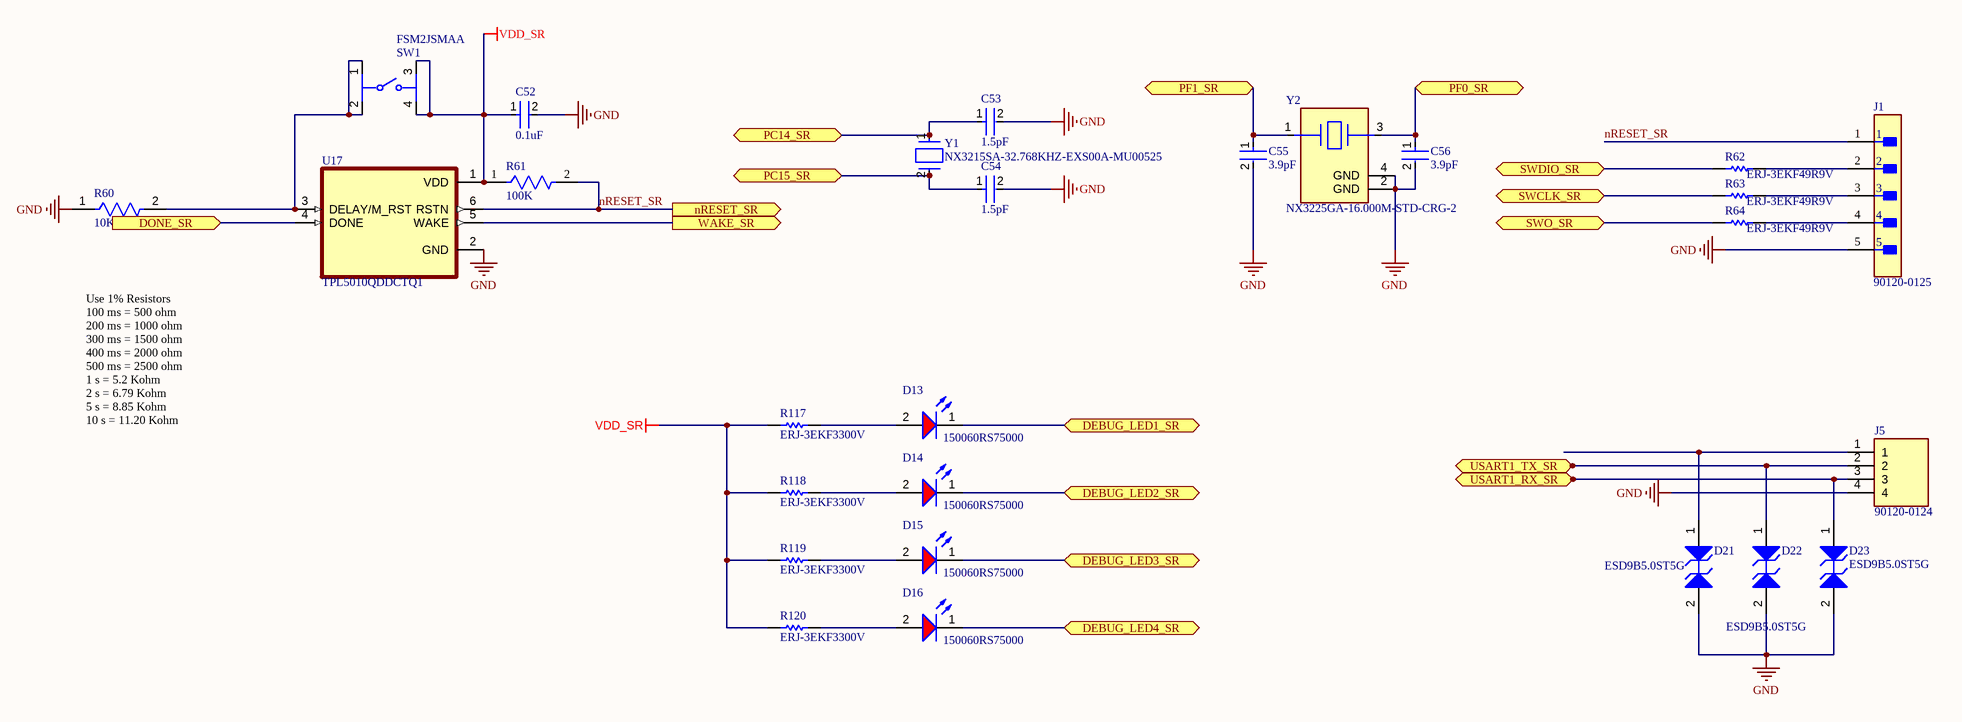
[diagram p16: SRIC_Peripherals.SchDoc]

### Parts
C52  0.1uF  [FP-C0603C-CF-MFG]
C53  1.5pF  [FP-C0603C-CF-MFG]
C54  1.5pF  [FP-C0603C-CF-MFG]
C55  3.9pF  [FP-CBR06C-MFG]
C56  3.9pF  [FP-CBR06C-MFG]
D13  150060RS75000  [WL-SMCW_0603_150060xx75000]
D14  150060RS75000  [WL-SMCW_0603_150060xx75000]
D15  150060RS75000  [WL-SMCW_0603_150060xx75000]
D16  150060RS75000  [WL-SMCW_0603_150060xx75000]
D21  ESD9B5.0ST5G  [ONSC-SOD-923-2-514AB-01_V]
D22  ESD9B5.0ST5G  [ONSC-SOD-923-2-514AB-01_V]
D23  ESD9B5.0ST5G  [ONSC-SOD-923-2-514AB-01_V]
J1  90120-0125  [FP-90120-0125-MFG]
J5  90120-0124  [HDRV4W65P0X254_1X4_1016X254X945P]
R60  10K  [FP-RK73B1J-MFG]
R61  100K  [FP-ERA3A-MFG]
R62  ERJ-3EKF49R9V  [RESC1608X55X30ML15T15]
R63  ERJ-3EKF49R9V  [RESC1608X55X30ML15T15]
R64  ERJ-3EKF49R9V  [RESC1608X55X30ML15T15]
R117  ERJ-3EKF3300V  [RESC1608X55X30LL15T15]
R118  ERJ-3EKF3300V  [RESC1608X55X30LL15T15]
R119  ERJ-3EKF3300V  [RESC1608X55X30LL15T15]
R120  ERJ-3EKF3300V  [RESC1608X55X30LL15T15]
SW1  FSM2JSMAA  [FP-FSM2JSMAA-MFG]
U17  TPL5010QDDCTQ1  [SOT95P280X110-6N]
Y1  NX3215SA-32.768KHZ-EXS00A-MU00525  [FP-NX3215SA-MFG]
Y2  NX3225GA-16.000M-STD-CRG-2  [FP-NX3225GA-MFG]

### Ports
DEBUG_LED1_SR (bidir), DEBUG_LED2_SR (bidir), DEBUG_LED3_SR (bidir), DEBUG_LED4_SR (bidir), DONE_SR (in), nRESET_SR (out), PC14_SR (bidir), PC15_SR (bidir), PF0_SR (bidir), PF1_SR (bidir), SWCLK_SR (bidir), SWDIO_SR (bidir), SWO_SR (bidir), USART1_RX_SR (bidir), USART1_TX_SR (bidir), WAKE_SR (out)

### Nets
GND: C52.2 C53.2 C54.2 C55.2 C56.2 D21.2(A2) D22.2(A2) D23.2(A2) J1.5 J5.4 R60.1 U17.2(GND) Y2.2(GND) Y2.4(GND)
VDD_SR: C52.1 R61.1 R117.1 R118.1 R119.1 R120.1 SW1.3 SW1.4 U17.1(VDD)
DEBUG_LED1_SR: D13.1(K) ; port DEBUG_LED1_SR
DEBUG_LED2_SR: D14.1(K) ; port DEBUG_LED2_SR
DEBUG_LED3_SR: D15.1(K) ; port DEBUG_LED3_SR
DEBUG_LED4_SR: D16.1(K) ; port DEBUG_LED4_SR
DONE_SR: U17.4(DONE) ; port DONE_SR
nRESET_SR: J1.1 R61.2 U17.6(RSTN) ; port nRESET_SR
PC14_SR: C53.1 Y1.1 ; port PC14_SR
PC15_SR: C54.1 Y1.2 ; port PC15_SR
PH0_SR: C56.1 Y2.3 ; port PF0_SR
PH1_SR: C55.1 Y2.1 ; port PF1_SR
SWCLK_SR: R63.1 ; port SWCLK_SR
SWDIO_SR: R62.1 ; port SWDIO_SR
SWO_SR: R64.1 ; port SWO_SR
USART1_RX_SR: D23.1(A1) J5.3 ; port USART1_RX_SR
USART1_TX_SR: D22.1(A1) J5.2 ; port USART1_TX_SR
WAKE_SR: U17.5(WAKE) ; port WAKE_SR
NetD13_2: D13.2(A) R117.2
NetD14_2: D14.2(A) R118.2
NetD15_2: D15.2(A) R119.2
NetD16_2: D16.2(A) R120.2
NetD21_1: D21.1(A1) J5.1
NetJ1_2: J1.2 R62.2
NetJ1_3: J1.3 R63.2
NetJ1_4: J1.4 R64.2
NetR60_2: R60.2 SW1.1 SW1.2 U17.3(DELAY/M_RST)

### Notes on the sheet
- Use 1% Resistors
  100 ms = 500 ohm
  200 ms = 1000 ohm
  300 ms = 1500 ohm
  400 ms = 2000 ohm
  500 ms = 2500 ohm
  1 s = 5.2 Kohm
  2 s = 6.79 Kohm
  5 s = 8.85 Kohm
  10 s = 11.20 Kohm
- THIS DOCUMENT AND THE DATA DISCLOSED HEREIN OR
- HEREWITH IS THE PROPERTY OF ALTIUM LIMITED AND MAY
- DWG NO:
- REVISION
- REV:
- DESCRIPTION
- DATE
- APPROVED
- BE FREELY DISTRIBUTED IN WHOLE. NO RIGHTS ARE
- RESERVED OR EXPRESS OR IMPLIED WARANTEE GIVEN.
- ENG:
- APPROVALS
- PROJECT
- DSN:
- CHK:
- REFERENCE DOCUMENTS
- PROJECT REVISION:
- TITLE
- DOCUMENT REVISION:
- DESIGN ITEM:
- BOM:
- FAB DWG:
- PCB DWG:
- ASSY DWG:
- SCALE:
- A3
- SIZE
- CAGE CODE
- FILE NAME
- DWG NO.
- SHEET
- OF
- REV

### Library data of the parts
C52 = CMP-2006-03061-2: as C49 on sheet SetResetIC; Temperature: -55°C to +125°C; RoHS: TRUE; Temperature Range High: +125°C; Lead Free: Yes; Octopart: https://octopart.com/c0603c104k5ractu-kemet-139244; Digikey Description: CAP CER 0.1UF 50V X7R 0603; Category: Cap; Package: C0603C-CF; ComponentLink2Description: Datasheet; Temperature Range Low: -55°C; Device Class L1: Passive Components; Voltage Rating: 50 V; Automotive: Yes; Device Class L3: Ceramic Capacitors; ComponentLink2URL: https://api.kemet.com/component-edge/download/datasheet/C0603C100J5GACAUTO.pdf; Capacitance: 0.10 μF; Device Class L2: Capacitors; Temperature Characteristic: X7R; Height: 0.87mm
C53 C54 = CMP-2006-03373-2: CAP CER 1.5PF 100V NP0 0603; Manufacturer Part Number: C0603C159C1GACTU; Manufacturer: KEMET; Material: Ceramic; Temperature Coefficient: 30ppm/°C; Temperature Characteristic: C0G; Tolerance: 0.25 pF; Automotive Grade: Grade 1; Mouser Description: Multilayer Ceramic Capacitors MLCC - SMD/SMT 100volts 1.5pF C0G 0.25%; Lead Free: Yes; Value: 1.5 pF; Temperature Range Low: -55°C; Temperature: -55°C to +125°C; Device Class L1: Passive Components; Device Class L3: Ceramic Capacitors; Package: C0603C-CF; Category: Cap; ComponentLink2Description: Datasheet; Voltage Rating: 100 V; Device Class L2: Capacitors; Height: 0.87mm; Temperature Range High: +125°C; RoHS: TRUE; Octopart: https://octopart.com/c0603c159c1gactu-kemet-9144220; Digikey Description: CAP CER 1.5PF 100V NP0 0603; Automotive: Yes; ComponentLink2URL: https://api.kemet.com/component-edge/download/datasheet/C0603C100J5GACAUTO.pdf; Capacitance: 1.5 pF
C55 C56 = CMP-2006-02987-2: CAP CER 3.9PF 250V C0G/NP0 0603; Manufacturer Part Number: CBR06C399CAGAC; Manufacturer: KEMET; Material: Ceramic; Tolerance: 0.25 pF; Temperature Characteristic: C0G; Temperature Coefficient: 30ppm/°C; Octopart: https://octopart.com/cbr06c399cagac-kemet-20446767; Height: 0.87mm; Category: Cap; Temperature: -55°C to +125°C; Device Class L1: Passive Components; Capacitance: 3.9 pF; Device Class L3: Ceramic Capacitors; Value: 3.9 pF; Voltage Rating: 250 V; Mouser Description: Multilayer Ceramic Capacitors MLCC - SMD/SMT 250volts 3.9pF C0G 0603 .25pF Tol RF; Temperature Range High: +125°C; Ipc Land Pattern Name: CAPC16080X80; ComponentLink2Description: Datasheet; Temperature Range Low: -55°C; Digikey Description: CAP CER 3.9PF 250V C0G/NP0 0603; ComponentLink2URL: https://content.kemet.com/datasheets/KEM_C1030_CBR_SMD.pdf; Lead Free: Yes; Package: CBR06C; Device Class L2: Capacitors; RoHS: TRUE; Automotive: No
D13-D16 = CMP-1426-00001-4: LED Low-Power Uni-Color Red 630nm 2V 2-Pin Chip 0603(1608Metric) T/R; Max Junction Temperature (Tj): 95°C; Dominant Wavelength: 625nm; Lens Style: Clear, Rectangular; Viewing Angle: 140°; Forward Current: 100mA; Max Reverse Voltage (DC): 5V; Luminous Intensity: 250mcd; Test Current: 20mA; Power Dissipation: 72mW; Max Operating Temperature: 85°C; Mount: Surface Mount; Height: 700µm; Packaging: Tape and Reel; REACH SVHC: Unknown; Case Code (Metric): 1608; Peak Wavelength: 630nm; Forward Voltage: 2V; Case/Package: 0603; Color: Red; RoHS: Compliant; Width: 800µm; Reverse Voltage: 5V; Min Operating Temperature: -40°C; Wavelength: 625nm; Case Code (Imperial): 0603; Length: 1.6mm
D21-D23 = CMP-1063-00119-1: Transient Voltage Suppressor, Micro-Packaged Diode for ESD Protection, 2-Pin SOD-923, Pb-Free, Tape and Reel; Manufacturer: On Semiconductor; Number of Lines: 1; Direction: Bidirectional; V(BR) Min (V): 5.8; VRWM Max (V): 5; Packing: Tape and Reel; PackageDescription: 2-Pin SOD, Body 0.8 x 0.6 mm; IR Max (uA): 1; ComponentLink3Description: Package Specification; PartNumber: ESD9B5.0ST5G; ComponentLink1URL: http://www.onsemi.com/; RoHS: Pb-Free; Mounting Technology: Surface Mount; DatasheetVersion: Rev. 2; ComponentLink2URL: http://www.onsemi.cn/pub_link/Collateral/ESD9B-D.PDF; ComponentLink3URL: http://www.onsemi.com/pub_link/Collateral/514AB.PDF; PackageReference: SOD-923-2-514AB-01; PackageVersion: Rev. C, 03/2011; ComponentLink1Description: Manufacturer URL; ComponentLink2Description: Datasheet
J1 = CMP-00257-00655425-1: 90120-0125 2.54mm Pitch C-Grid III Header, Single Row, Vertical, 5 Circuits, Tin (Sn) Plating; NexarPartId: 655425; Manufacturer Lifecycle Status: ACTIVE; Lead Length: 2.9mm; Number of Positions: 5; Current Rating: 3A; Mating Post Length: 6.75mm; Glow Wire Compliant: Non-compliant; Contact Resistance: 20mΩ; Voltage Rating: 350V; Gender: Male; Max Voltage Rating (DC): 350.35kV; Max Operating Temperature: 125°C; Number of Pins: 5; Plating: Tin; Contact Material: Brass; Mount: Through Hole; Contact Gender: Male; Packaging: Bulk; Schedule B: 8536694040; Lifecycle Status: Production; Lead Pitch: 2.54mm; Radiation Hardening: No; Orientation: Vertical; Min Operating Temperature: -55°C; Country of Origin: SK; Housing Color: Black; REACH SVHC: No SVHC; Contact Plating: Tin; Number of Rows: 1; Number of Circuits: 5; Termination: Solder; Number of Contacts: 5; Pitch: 2.54mm; Housing Material: Polyester; RoHS: Compliant; Lead Free: Lead Free; Voltage Rating (AC): 350V
J5 = 90120-0124: Connector; Manufacturer_Name: Molex; Datasheet Link: https://componentsearchengine.com/Datasheets/2/90120-0124.pdf; Height: 9.45mm; Manufacturer_Part_Number: 90120-0124; Mouser Part Number: 538-90120-0124; Mouser Price/Stock: https://www.mouser.co.uk/ProductDetail/Molex/90120-0124?qs=PvP5v7EimsmprSEogp1JLQ%3D%3D
R60 = CMP-2000-01851-2: RES 10K OHM 5% 1/10W 0603; Temperature Coefficient: 200ppm/°C; Voltage Rating: 50V; Power Rating: 100mW; Resistance: 10kR; Length: 1.6mm; Lead Free: Lead Free; Resistance Tolerance: 5%; Case Code (Metric): 1608; Width: 0.8mm; Height: 0.45mm; Max Operating Temperature: 155°C; RoHS Compliant: Yes; Resistor Type: Thick Film; Min Operating Temperature: -55°C; Case Code (Imperial): 0603; Technology: THICK FILM; Package Quantity: 5000; Tolerance: 5%; Case/Package: 0603; Voltage Rating (DC): 50V; Depth: 0.8mm; Packaging: Tape and Reel; Number of Pins: 2; Construction: Rectangular; Series: RK73B; Military Standard: Not; Termination: SMD/SMT
R61 = CMP-2000-00875-2: NexarPartId: 1243428; Power Rating: 100mW; Voltage Rating (DC): 75V; Tolerance: 0.1%; Temperature Coefficient: 25ppm/°C; Resistance: 100kΩ; Contact Plating: Tin; Max Operating Temperature: 155°C; Case Code (Imperial): 0603; Packaging: Cut Tape; Width: 800µm; Lead Free: Lead Free; REACH SVHC: No SVHC; Termination: SMD/SMT; Radiation Hardening: No; Length: 1.6mm; Military Standard: Not; Features: Automotive AEC-Q200; Case/Package: 0603; Number of Terminations: 2; Composition: Thin Film; Schedule B: 8533210045, 8533210045; Voltage Rating: 75V; Mount: Surface Mount; Case Code (Metric): 1608; Lifecycle Status: Production; Height: 450µm; RoHS: Compliant; Number of Pins: 2; Max Power Dissipation: 100mW; Min Operating Temperature: -55°C; Depth: 800µm; Working Voltage: 75V
R62-R64 = CMP-2000-00538-1: Manufacturer: Panasonic; Part Number: ERJ-3EKF49R9V
R117-R120 = CMP-2000-00435-2: Chip Resistor, 330 Ohm, +/- 1%, 0.1 W, -55 to 155 degC, 0603 (1608 Metric), RoHS, Tape and Reel; Gender: Male; Mating Cycles: 10000; Current Rating: 500 mA; Voltage Rating: 10 V; REACH SVHC: No SVHC; PackageDescription: 2-Pin Surface Mount Device, Body 1.6 x 0.85 mm; Contact Finish: Gold; Pins: 8; ComponentLink1Description: Manufacturer URL; Packaging: Tape and Reel; Max Operating Temperature: 85 degC; Contact Material: Copper; Height: 1.45 mm; Width: 1.45 mm; DatasheetVersion: Apr-15; Package Quantity: 1500; Contact Plating: Gold; PackageReference: 0603; Mount: Surface Mount; Lead Pitch: 1.1 mm; Min Operating Temperature: -25 degC; ComponentLink1URL: http://www.panasonic.com/; ComponentLink2URL: http://industrial.panasonic.com/cdbs/www-data/pdf/RDA0000/AOA0000C86.pdf; Length: 13.7 mm; ComponentLink2Description: Datasheet; RoHSCompliant: true
SW1 = CMP-03402-000003-1: SWITCH TACTILE SPST-NO 0.05A 24V; Manufacturer: TE Connectivity; Standoff Height: 0.05mm; Contact Current Rating: 50mA; Electromechanical Life: 100000Cycles; Operating Force: 260gf; Contact Resistance: 100mΩ; Package: 0; Temperature Range High: +85°C; Temperature: -35°C to +85°C; Category: Switch; Manufacturer Part Number: FSM2JSMAA; RoHS: TRUE; Mouser Description: Tactile Switches TACTILE 260G FORCE S; Device Class L1: Electromechanical; Mount: Surface Mount; Height: 4.59mm; ComponentLink2URL: https://www.te.com/commerce/DocumentDelivery/DDEController?Action=showdoc&DocId=Customer+Drawing%7F2-1437565-7%7FV%7Fpdf%7FEnglish%7FENG_CD_2-1437565-7_V.pdf%7F2-1437565-8; Temperature Range Low: -35°C; Voltage Rating Dc: 24V; Lead Free: Yes; Automotive: No; Throw Configuration: SPST-NO; Octopart: https://octopart.com/fsm2jsmaa-te+connectivity-41720620; Device Class L2: Switches; Device Class L3: Pushbutton Switches; ComponentLink2Description: Datasheet; Digikey Description: SWITCH TACTILE SPST-NO 0.05A 24V
U17 = CMP-049-000000-1: Automotive AEC-Q100, nano-powered system timer with watchdog function; MF: Texas Instruments; MP: TPL5010QDDCTQ1; Check_prices: https://www.snapeda.com/parts/TPL5010QDDCTQ1/Texas+Instruments/view-part/?ref=eda; Source: TPL5010QDDCTQ1.SchLib; Package: SOT-23-THN-6 Texas Instruments; SnapEDA_Link: https://www.snapeda.com/parts/TPL5010QDDCTQ1/Texas+Instruments/view-part/?ref=snap; Component Type: Standard; Value: *; Pin Count: 6; Design Item ID: TPL5010QDDCTQ1
Y1 = CMP-200220-000018-1: CRYSTAL 32.7680KHZ 6PF SMD; ESR (Equivalent Series Resistance): 70kR; Load Capacitance: 6pF; Frequency: 32.768kHz; Case/Package: SMD/SMT; Packaging: Tape and Reel; Ratings: AEC-Q200; Max Operating Temperature: 85°C; Mount: Surface Mount; Min Operating Temperature: -40°C
Y2 = CMP-200220-000007-1: CRYSTAL 16.0000MHZ 8PF SMD; Frequency Stability: 30ppm; Frequency Tolerance: 20ppm; Frequency: 16MHz; ESR (Equivalent Series Resistance): 80R; Min Operating Temperature: -40°C; Mount: Surface Mount; Width: 0.098inch; Case/Package: SMD/SMT; Max Operating Temperature: 85°C; Number of Pins: 4; Length: 0.126inch; Load Capacitance: 8pF; Packaging: Tape and Reel; Package Quantity: 3000; Height: 0.035inch

## Sheet OR_Gate.SchDoc
size 420 x 297 mm; SheetNumber: 16; SheetTotal: 21
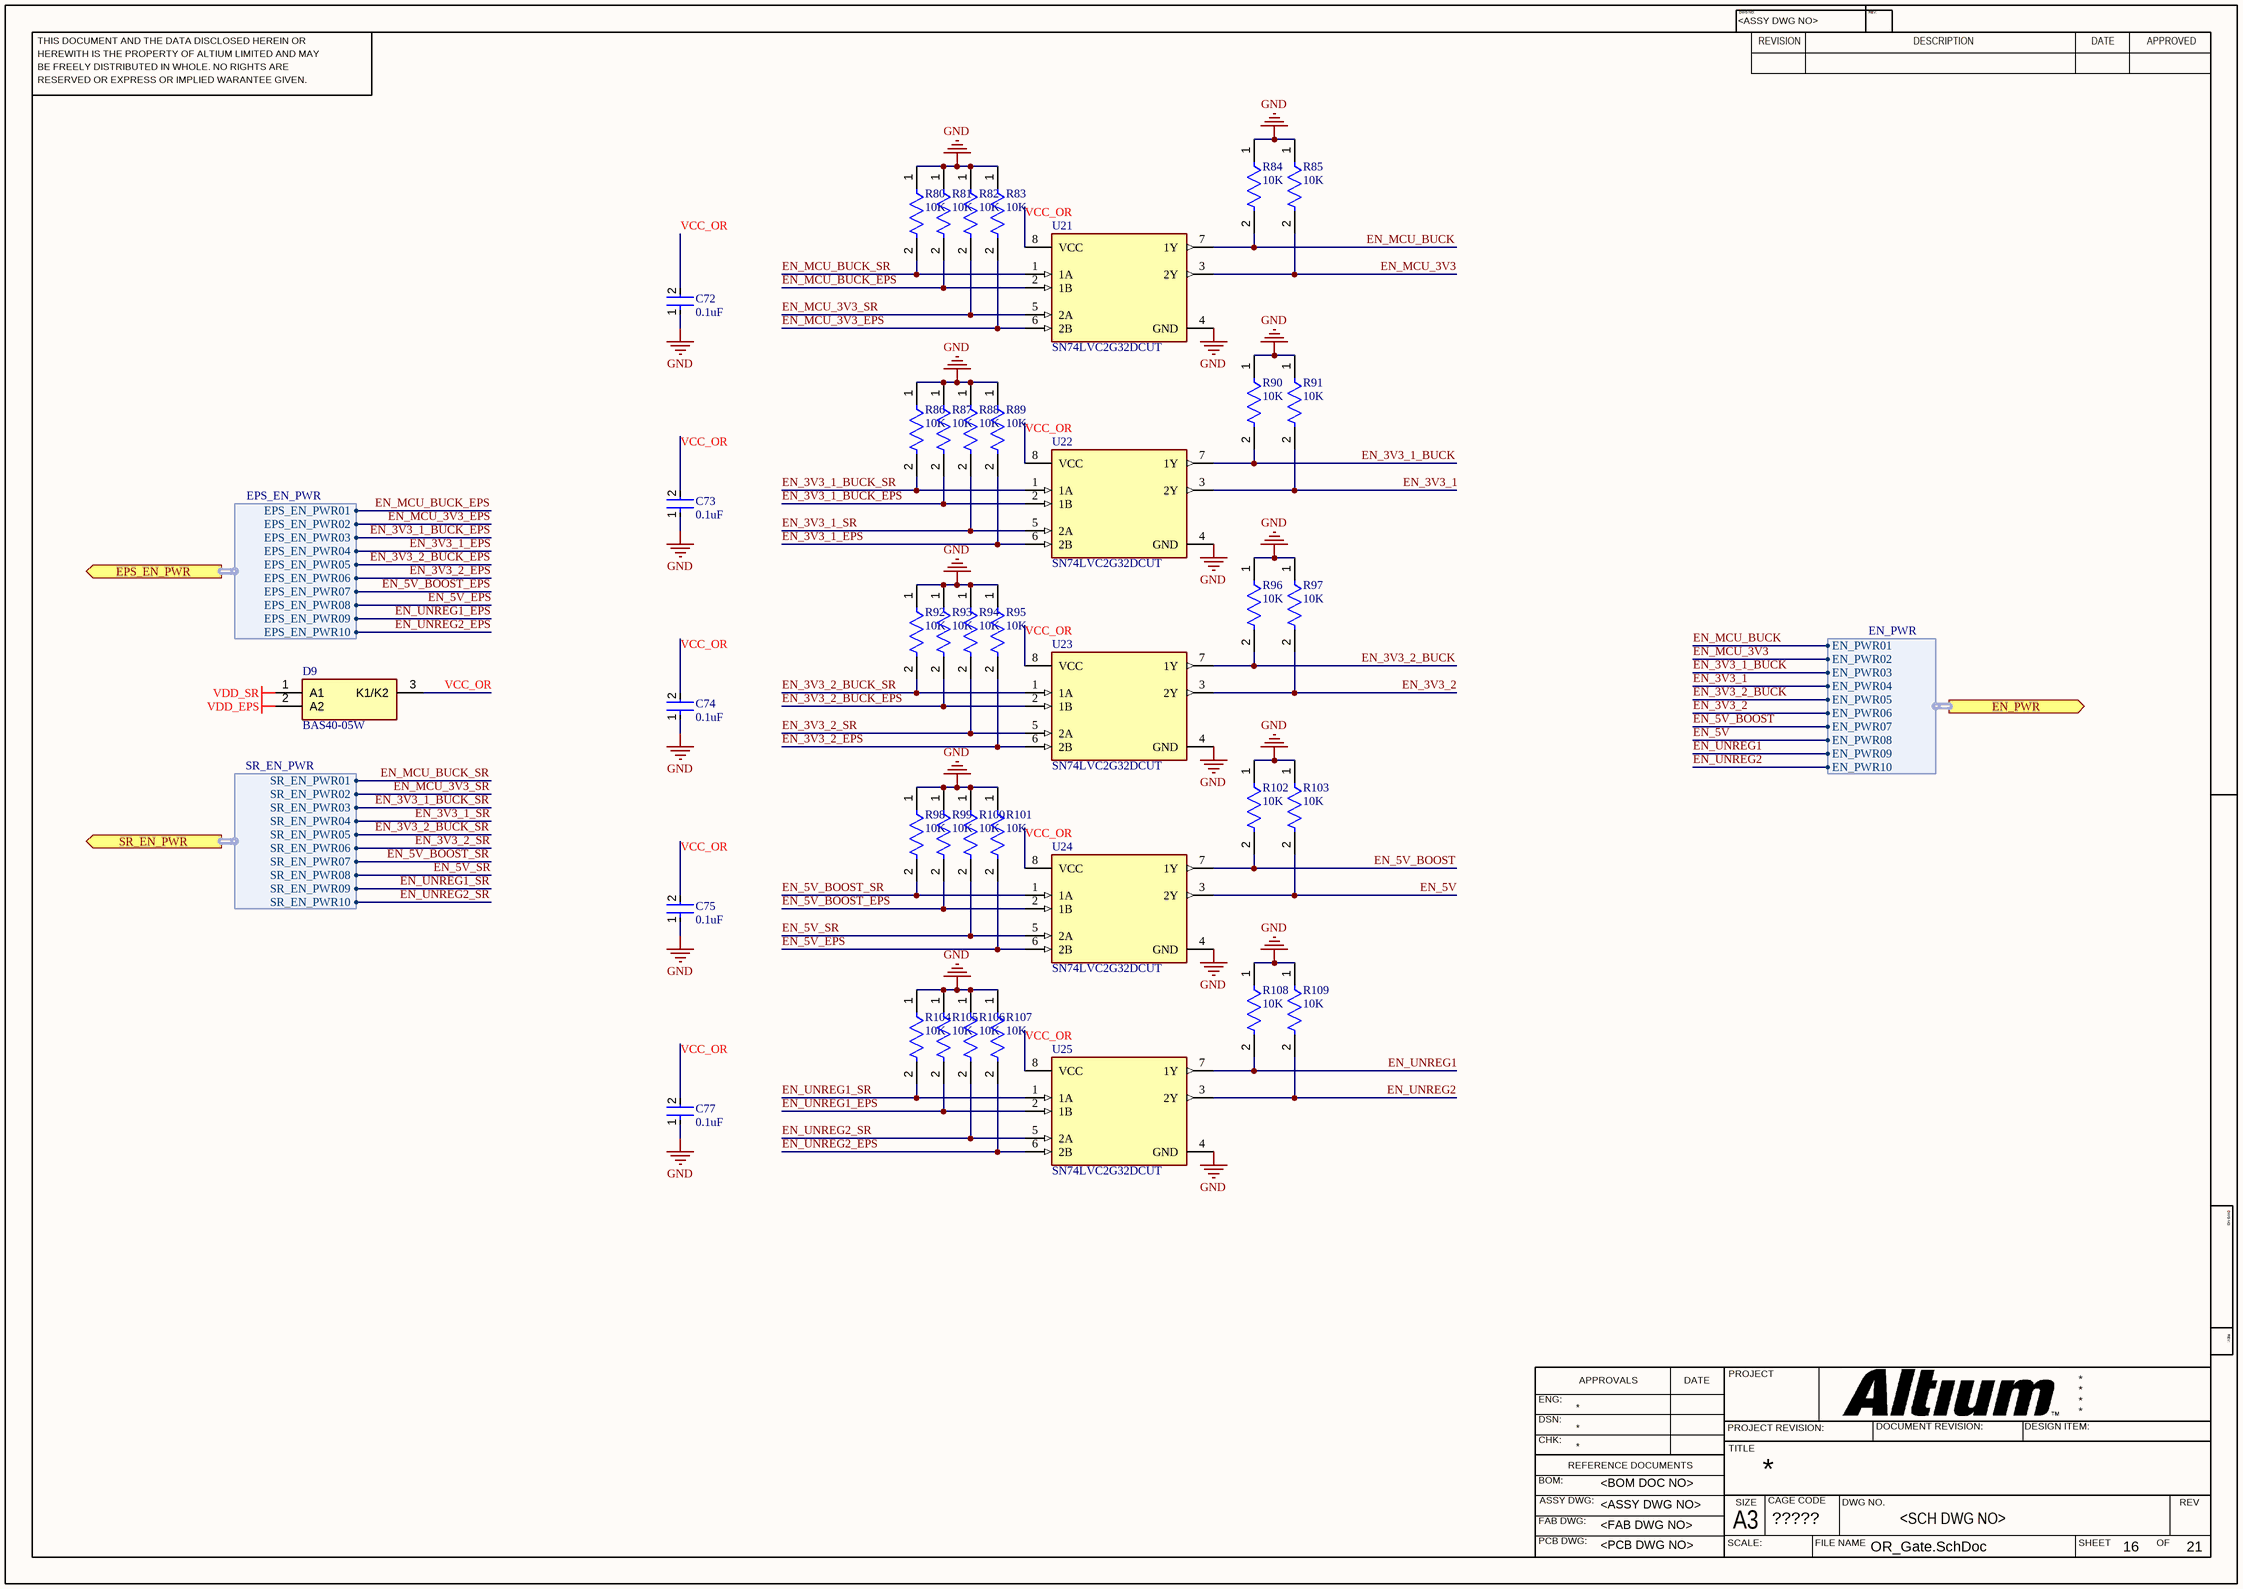
[diagram p17: OR_Gate.SchDoc]

### Parts
C72  0.1uF  [FP-C0603C-CF-MFG]
C73  0.1uF  [FP-C0603C-CF-MFG]
C74  0.1uF  [FP-C0603C-CF-MFG]
C75  0.1uF  [FP-C0603C-CF-MFG]
C77  0.1uF  [FP-C0603C-CF-MFG]
D9  BAS40-05W  [SOT65P210X110-3N]
R80  10K  [FP-RK73B1J-MFG]
R81  10K  [FP-RK73B1J-MFG]
R82  10K  [FP-RK73B1J-MFG]
R83  10K  [FP-RK73B1J-MFG]
R84  10K  [FP-RK73B1J-MFG]
R85  10K  [FP-RK73B1J-MFG]
R86  10K  [FP-RK73B1J-MFG]
R87  10K  [FP-RK73B1J-MFG]
R88  10K  [FP-RK73B1J-MFG]
R89  10K  [FP-RK73B1J-MFG]
R90  10K  [FP-RK73B1J-MFG]
R91  10K  [FP-RK73B1J-MFG]
R92  10K  [FP-RK73B1J-MFG]
R93  10K  [FP-RK73B1J-MFG]
R94  10K  [FP-RK73B1J-MFG]
R95  10K  [FP-RK73B1J-MFG]
R96  10K  [FP-RK73B1J-MFG]
R97  10K  [FP-RK73B1J-MFG]
R98  10K  [FP-RK73B1J-MFG]
R99  10K  [FP-RK73B1J-MFG]
R100  10K  [FP-RK73B1J-MFG]
R101  10K  [FP-RK73B1J-MFG]
R102  10K  [FP-RK73B1J-MFG]
R103  10K  [FP-RK73B1J-MFG]
R104  10K  [FP-RK73B1J-MFG]
R105  10K  [FP-RK73B1J-MFG]
R106  10K  [FP-RK73B1J-MFG]
R107  10K  [FP-RK73B1J-MFG]
R108  10K  [FP-RK73B1J-MFG]
R109  10K  [FP-RK73B1J-MFG]
U21  SN74LVC2G32DCUT  [FP-DCU0008A-IPC_B]
U22  SN74LVC2G32DCUT  [FP-DCU0008A-IPC_B]
U23  SN74LVC2G32DCUT  [FP-DCU0008A-IPC_B]
U24  SN74LVC2G32DCUT  [FP-DCU0008A-IPC_B]
U25  SN74LVC2G32DCUT  [FP-DCU0008A-IPC_B]

### Ports
EN_PWR (out, harness EN_PWR), EPS_EN_PWR (out, harness EPS_EN_PWR), SR_EN_PWR (out, harness SR_EN_PWR)

### Harnesses
EPS_EN_PWR: EPS_EN_PWR01, EPS_EN_PWR02, EPS_EN_PWR03, EPS_EN_PWR04, EPS_EN_PWR05, EPS_EN_PWR06, EPS_EN_PWR07, EPS_EN_PWR08, EPS_EN_PWR09, EPS_EN_PWR10
SR_EN_PWR: SR_EN_PWR01, SR_EN_PWR02, SR_EN_PWR03, SR_EN_PWR04, SR_EN_PWR05, SR_EN_PWR06, SR_EN_PWR07, SR_EN_PWR08, SR_EN_PWR09, SR_EN_PWR10
EN_PWR: EN_PWR01, EN_PWR02, EN_PWR03, EN_PWR04, EN_PWR05, EN_PWR06, EN_PWR07, EN_PWR08, EN_PWR09, EN_PWR10

### Nets
GND: C72.1 C73.1 C74.1 C75.1 C77.1 R80.1 R81.1 R82.1 R83.1 R84.1 R85.1 R86.1 R87.1 R88.1 R89.1 R90.1 R91.1 R92.1 R93.1 R94.1 R95.1 R96.1 R97.1 R98.1 R99.1 R100.1 R101.1 R102.1 R103.1 R104.1 R105.1 R106.1 R107.1 R108.1 R109.1 U21.4(GND) U22.4(GND) U23.4(GND) U24.4(GND) U25.4(GND)
VDD_EPS: D9.2(A2)
VDD_SR: D9.1(A1)
EN_3V3_1: R91.2 U22.3(2Y) ; port EN_PWR.EN_PWR04
EN_3V3_1_BUCK: R90.2 U22.7(1Y) ; port EN_PWR.EN_PWR03
EN_3V3_1_BUCK_EPS: R87.2 U22.2(1B) ; port EPS_EN_PWR.EPS_EN_PWR03
EN_3V3_1_BUCK_SR: R86.2 U22.1(1A) ; port SR_EN_PWR.SR_EN_PWR03
EN_3V3_1_EPS: R89.2 U22.6(2B) ; port EPS_EN_PWR.EPS_EN_PWR04
EN_3V3_1_SR: R88.2 U22.5(2A) ; port SR_EN_PWR.SR_EN_PWR04
EN_3V3_2: R97.2 U23.3(2Y) ; port EN_PWR.EN_PWR06
EN_3V3_2_BUCK: R96.2 U23.7(1Y) ; port EN_PWR.EN_PWR05
EN_3V3_2_BUCK_EPS: R93.2 U23.2(1B) ; port EPS_EN_PWR.EPS_EN_PWR05
EN_3V3_2_BUCK_SR: R92.2 U23.1(1A) ; port SR_EN_PWR.SR_EN_PWR05
EN_3V3_2_EPS: R95.2 U23.6(2B) ; port EPS_EN_PWR.EPS_EN_PWR06
EN_3V3_2_SR: R94.2 U23.5(2A) ; port SR_EN_PWR.SR_EN_PWR06
EN_5V: R103.2 U24.3(2Y) ; port EN_PWR.EN_PWR08
EN_5V_BOOST: R102.2 U24.7(1Y) ; port EN_PWR.EN_PWR07
EN_5V_BOOST_EPS: R99.2 U24.2(1B) ; port EPS_EN_PWR.EPS_EN_PWR07
EN_5V_BOOST_SR: R98.2 U24.1(1A) ; port SR_EN_PWR.SR_EN_PWR07
EN_5V_EPS: R101.2 U24.6(2B) ; port EPS_EN_PWR.EPS_EN_PWR08
EN_5V_SR: R100.2 U24.5(2A) ; port SR_EN_PWR.SR_EN_PWR08
EN_MCU_3V3: R85.2 U21.3(2Y) ; port EN_PWR.EN_PWR02
EN_MCU_3V3_EPS: R83.2 U21.6(2B) ; port EPS_EN_PWR.EPS_EN_PWR02
EN_MCU_3V3_SR: R82.2 U21.5(2A) ; port SR_EN_PWR.SR_EN_PWR02
EN_MCU_BUCK: R84.2 U21.7(1Y) ; port EN_PWR.EN_PWR01
EN_MCU_BUCK_EPS: R81.2 U21.2(1B) ; port EPS_EN_PWR.EPS_EN_PWR01
EN_MCU_BUCK_SR: R80.2 U21.1(1A) ; port SR_EN_PWR.SR_EN_PWR01
EN_UNREG1: R108.2 U25.7(1Y) ; port EN_PWR.EN_PWR09
EN_UNREG1_EPS: R105.2 U25.2(1B) ; port EPS_EN_PWR.EPS_EN_PWR09
EN_UNREG1_SR: R104.2 U25.1(1A) ; port SR_EN_PWR.SR_EN_PWR09
EN_UNREG2: R109.2 U25.3(2Y) ; port EN_PWR.EN_PWR10
EN_UNREG2_EPS: R107.2 U25.6(2B) ; port EPS_EN_PWR.EPS_EN_PWR10
EN_UNREG2_SR: R106.2 U25.5(2A) ; port SR_EN_PWR.SR_EN_PWR10
VCC_OR: C72.2 C73.2 C74.2 C75.2 C77.2 D9.3(K1/K2) U21.8(VCC) U22.8(VCC) U23.8(VCC) U24.8(VCC) U25.8(VCC)

### Notes on the sheet
- THIS DOCUMENT AND THE DATA DISCLOSED HEREIN OR
- HEREWITH IS THE PROPERTY OF ALTIUM LIMITED AND MAY
- DWG NO:
- REVISION
- REV:
- DESCRIPTION
- DATE
- APPROVED
- BE FREELY DISTRIBUTED IN WHOLE. NO RIGHTS ARE
- RESERVED OR EXPRESS OR IMPLIED WARANTEE GIVEN.
- ENG:
- APPROVALS
- PROJECT
- DSN:
- CHK:
- REFERENCE DOCUMENTS
- PROJECT REVISION:
- TITLE
- DOCUMENT REVISION:
- DESIGN ITEM:
- BOM:
- FAB DWG:
- PCB DWG:
- ASSY DWG:
- SCALE:
- A3
- SIZE
- CAGE CODE
- FILE NAME
- DWG NO.
- SHEET
- OF
- REV

### Library data of the parts
C72-C75 C77 = CMP-2006-03061-2: as C49 on sheet SetResetIC; Temperature: -55°C to +125°C; RoHS: TRUE; Temperature Range High: +125°C; Lead Free: Yes; Octopart: https://octopart.com/c0603c104k5ractu-kemet-139244; Digikey Description: CAP CER 0.1UF 50V X7R 0603; Category: Cap; Package: C0603C-CF; ComponentLink2Description: Datasheet; Temperature Range Low: -55°C; Device Class L1: Passive Components; Voltage Rating: 50 V; Automotive: Yes; Device Class L3: Ceramic Capacitors; ComponentLink2URL: https://api.kemet.com/component-edge/download/datasheet/C0603C100J5GACAUTO.pdf; Capacitance: 0.10 μF; Device Class L2: Capacitors; Temperature Characteristic: X7R; Height: 0.87mm
D9 = BAS40-05W: Integrated Circuit; Manufacturer_Name: Nexperia; Datasheet Link: https://datasheet.datasheetarchive.com/originals/distributors/Datasheets-SFU1/DSASFU100010083.pdf; Height: 1.1mm; Manufacturer_Part_Number: BAS40-05W; Mouser Part Number: N/A; Mouser Price/Stock: https://www.mouser.co.uk/ProductDetail/Nexperia/BAS40-05W?qs=vHuUswq2%252BsxKDyywan0sHA%3D%3D
R80-R109 = CMP-2000-01851-2: as R60 on sheet SRIC_Peripherals; Length: 1.6mm; Lead Free: Lead Free; Resistance Tolerance: 5%; Case Code (Metric): 1608; Width: 0.8mm; Height: 0.45mm; Max Operating Temperature: 155°C; RoHS Compliant: Yes; Resistor Type: Thick Film; Min Operating Temperature: -55°C; Case Code (Imperial): 0603; Technology: THICK FILM; Package Quantity: 5000; Tolerance: 5%; Case/Package: 0603; Voltage Rating (DC): 50V; Depth: 0.8mm; Packaging: Tape and Reel; Number of Pins: 2; Construction: Rectangular; Series: RK73B; Military Standard: Not; Termination: SMD/SMT
U21-U25 = CMP-0859-00599-4: IC GATE OR 2CH 2-INP 8VSSOP; Number of Input Lines: 2; Operating Supply Voltage: 3.3V; Max Supply Voltage: 5.5V; Quiescent Current: 10uA; Min Supply Voltage: 1.65V; Number of Output Lines: 1; Turn-On Delay Time: 3.2ns; High Level Output Current: -32mA; Low Level Output Current: 32mA; Logic Function: OR GATE; Number of Bits: 2; Number of Pins: 8; REACH SVHC: No SVHC; Mount: Surface Mount; Number of Inputs: 2; Weight: 0.000339oz; Series: 74LVC; Lead Free: Lead Free; Number of Outputs: 1; Min Operating Temperature: -40°C; Termination: SMD/SMT; Number of Gates: 2; Number of Elements: 2; Package Quantity: 1; Max Operating Temperature: 125°C; Packaging: Tape and Reel; Number of Circuits: 2; Propagation Delay: 3.2ns; Case/Package: VSSOP; Radiation Hardening: No; Contact Plating: Gold; Max Output Current: 32mA; Technology: CMOS; Output Current: 32mA; RoHS Compliant: Yes